# Altium schematic sheet overall.SchDoc
size A
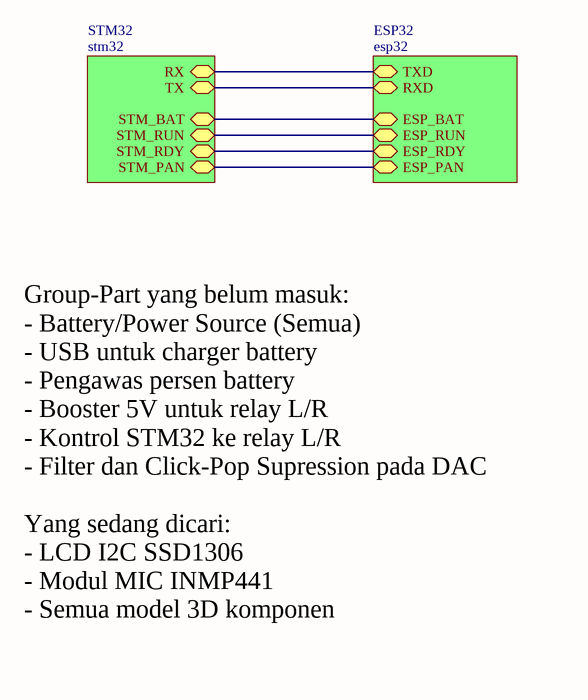
[diagram p0: overall.SchDoc]

## Sub-sheets
ESP32 = esp32: RXD, TXD, ESP_RDY, ESP_PAN, ESP_BAT, ESP_RUN
STM32 = stm32: TX, RX, STM_BAT, STM_RUN, STM_RDY, STM_PAN

## Nets
(unnamed): sheet ESP32/RXD, sheet STM32/TX
(unnamed): sheet ESP32/TXD, sheet STM32/RX
(unnamed): sheet ESP32/ESP_RDY, sheet STM32/STM_RDY
(unnamed): sheet ESP32/ESP_PAN, sheet STM32/STM_PAN
(unnamed): sheet ESP32/ESP_BAT, sheet STM32/STM_BAT
(unnamed): sheet ESP32/ESP_RUN, sheet STM32/STM_RUN

## Notes on the sheet
- Group-Part yang belum masuk:
  - Battery/Power Source (Semua)
  - USB untuk charger battery
  - Pengawas persen battery
  - Booster 5V untuk relay L/R
  - Kontrol STM32 ke relay L/R
  - Filter dan Click-Pop Supression pada DAC
  Yang sedang dicari:
  - LCD I2C SSD1306
  - Modul MIC INMP441
  - Semua model 3D komponen